# Altium schematic sheet BMU_V50_PackString.SchDoc
size C
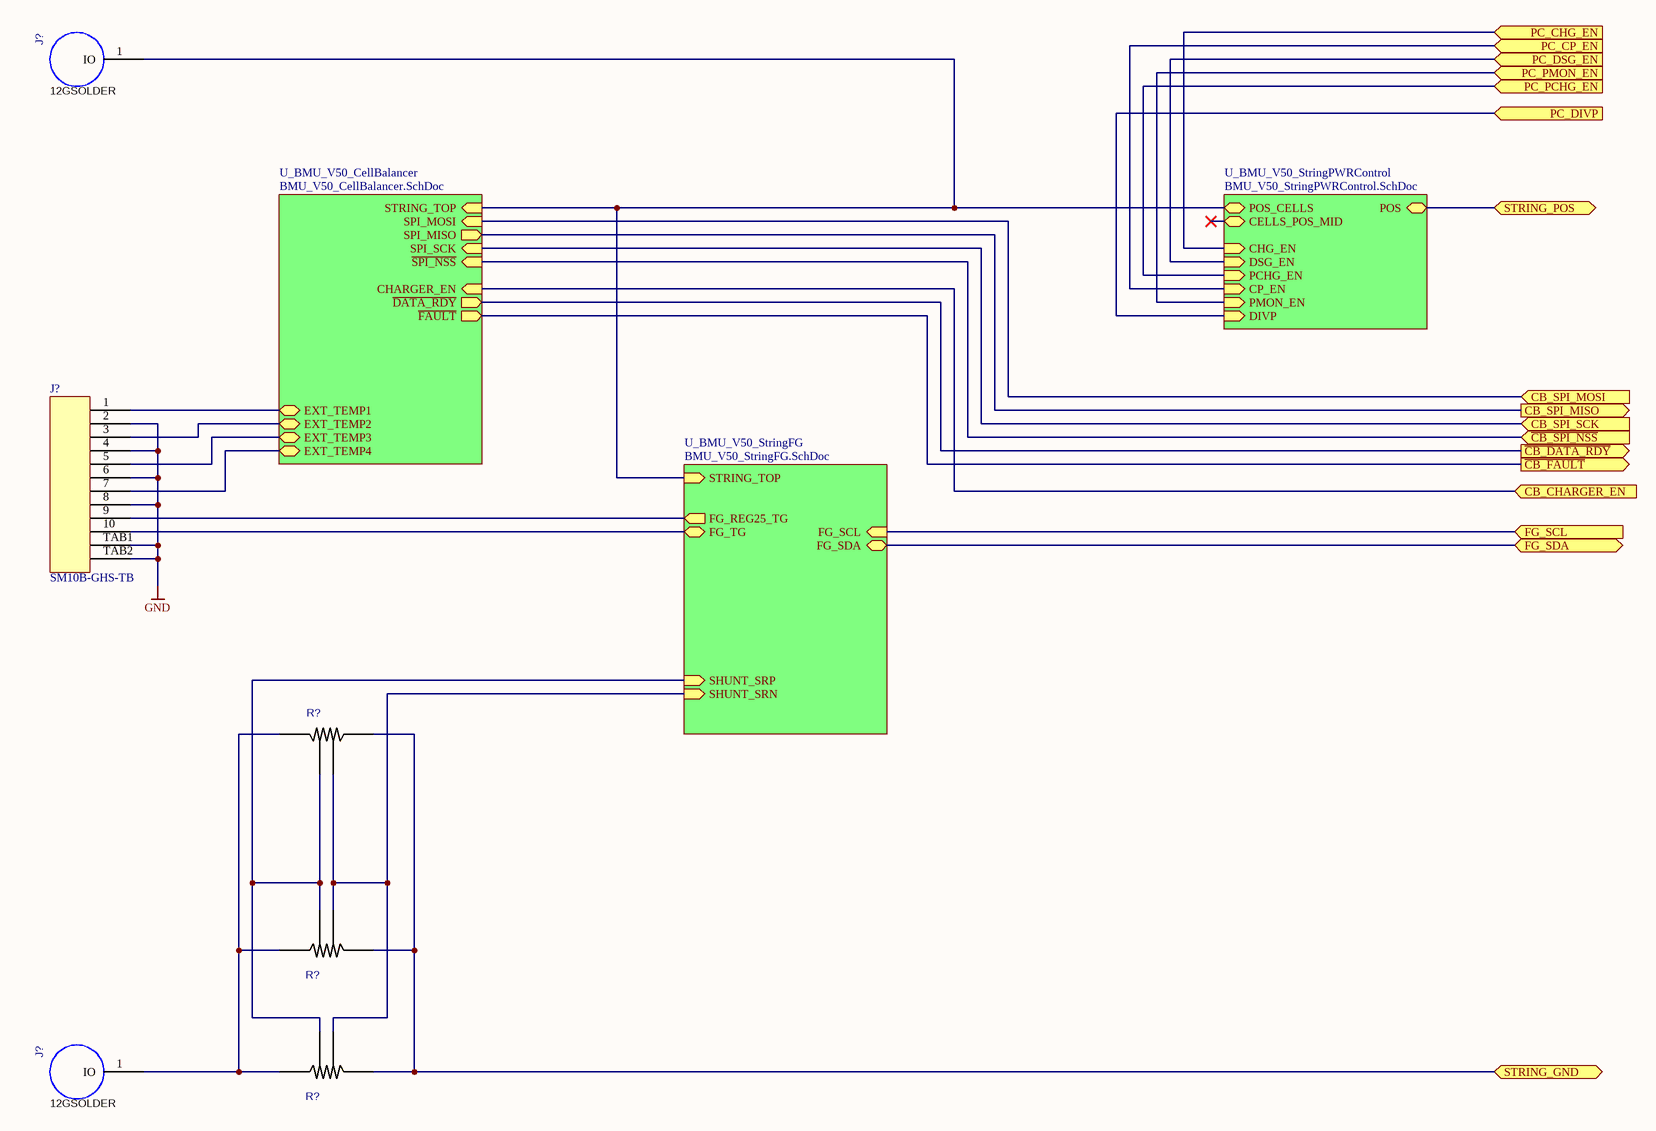
[diagram p0: BMU_V50_PackString.SchDoc]

## Parts
(Parts that share a designator on the sheet are numbered #1, #2 ... from top to bottom, then left to right.)
J?#1  12GSOLDER  [12GPAD]  (no BOM)
J?#2  SM10B-GHS-TB  [SM10B-GHS-TB]
J?#3  12GSOLDER  [12GPAD]  (no BOM)
R?#1  WSL59313L000FEA  [R5931]  (value not drawn)
R?#2  WSL59313L000FEA  [R5931]  (value not drawn)
R?#3  WSL59313L000FEA  [R5931]  (value not drawn)

## Sub-sheets
U_BMU_V50_CellBalancer = BMU_V50_CellBalancer.SchDoc: SPI_SCK (in), ~{SPI_NSS} (in), CHARGER_EN (in), SPI_MISO (out), ~{DATA_RDY} (out), ~{FAULT} (out), SPI_MOSI (in), STRING_TOP (in), EXT_TEMP4 (bidir), EXT_TEMP1 (bidir), EXT_TEMP2 (bidir), EXT_TEMP3 (bidir)
U_BMU_V50_StringFG = BMU_V50_StringFG.SchDoc: STRING_TOP (in), FG_REG25_TG (out), FG_SCL (in), FG_SDA (bidir), SHUNT_SRP (in), SHUNT_SRN (in), FG_TG (bidir)
U_BMU_V50_StringPWRControl = BMU_V50_StringPWRControl.SchDoc: DSG_EN (in), CP_EN (in), POS_CELLS (bidir), POS (bidir), CELLS_POS_MID (bidir), PCHG_EN (in), PMON_EN (in), DIVP (in), CHG_EN (in)

## Ports
CB_CHARGER_EN (in), CB_SPI_MISO (out), CB_SPI_MOSI (in), CB_SPI_SCK (in), FG_SCL (in), FG_SDA (bidir), PC_CHG_EN (in), PC_CP_EN (in), PC_DIVP (in), PC_DSG_EN (in), PC_PCHG_EN (in), PC_PMON_EN (in), STRING_GND (bidir), STRING_POS (bidir), ~{CB_DATA_RDY} (out), ~{CB_FAULT} (out), ~{CB_SPI_NSS} (in)

## Nets
GND: J?#2.2 J?#2.4 J?#2.6 J?#2.8 J?#2.TAB1 J?#2.TAB2
~{CB_DATA_RDY}: port ~{CB_DATA_RDY}, sheet U_BMU_V50_CellBalancer/~{DATA_RDY}
~{CB_FAULT}: port ~{CB_FAULT}, sheet U_BMU_V50_CellBalancer/~{FAULT}
~{CB_SPI_NSS}: port ~{CB_SPI_NSS}, sheet U_BMU_V50_CellBalancer/~{SPI_NSS}
CB_CHARGER_EN: port CB_CHARGER_EN, sheet U_BMU_V50_CellBalancer/CHARGER_EN
CB_SPI_MISO: port CB_SPI_MISO, sheet U_BMU_V50_CellBalancer/SPI_MISO
CB_SPI_MOSI: port CB_SPI_MOSI, sheet U_BMU_V50_CellBalancer/SPI_MOSI
CB_SPI_SCK: port CB_SPI_SCK, sheet U_BMU_V50_CellBalancer/SPI_SCK
FG_SCL: port FG_SCL, sheet U_BMU_V50_StringFG/FG_SCL
FG_SDA: port FG_SDA, sheet U_BMU_V50_StringFG/FG_SDA
PC_CHG_EN: port PC_CHG_EN, sheet U_BMU_V50_StringPWRControl/CHG_EN
PC_CP_EN: port PC_CP_EN, sheet U_BMU_V50_StringPWRControl/CP_EN
PC_DIVP: port PC_DIVP, sheet U_BMU_V50_StringPWRControl/DIVP
PC_DSG_EN: port PC_DSG_EN, sheet U_BMU_V50_StringPWRControl/DSG_EN
PC_PCHG_EN: port PC_PCHG_EN, sheet U_BMU_V50_StringPWRControl/PCHG_EN
PC_PMON_EN: port PC_PMON_EN, sheet U_BMU_V50_StringPWRControl/PMON_EN
STRING_GND: R?#1.2 R?#2.1 R?#3.1 ; port STRING_GND
STRING_POS: port STRING_POS, sheet U_BMU_V50_StringPWRControl/POS
NetJ?#1_1: J?#1.1(IO) ; sheet U_BMU_V50_StringFG/STRING_TOP, sheet U_BMU_V50_CellBalancer/STRING_TOP, sheet U_BMU_V50_StringPWRControl/POS_CELLS
NetJ?#2_1: J?#2.1 ; sheet U_BMU_V50_CellBalancer/EXT_TEMP1
NetJ?#2_3: J?#2.3 ; sheet U_BMU_V50_CellBalancer/EXT_TEMP2
NetJ?#2_5: J?#2.5 ; sheet U_BMU_V50_CellBalancer/EXT_TEMP3
NetJ?#2_7: J?#2.7 ; sheet U_BMU_V50_CellBalancer/EXT_TEMP4
NetJ?#2_9: J?#2.9 ; sheet U_BMU_V50_StringFG/FG_REG25_TG
NetJ?#2_10: J?#2.10 ; sheet U_BMU_V50_StringFG/FG_TG
NetJ?#3_1: J?#3.1(IO) R?#1.1 R?#2.2 R?#3.2
NetR?#1_3: R?#1.3 R?#2.4 R?#3.4 ; sheet U_BMU_V50_StringFG/SHUNT_SRP
NetR?#1_4: R?#1.4 R?#2.3 R?#3.3 ; sheet U_BMU_V50_StringFG/SHUNT_SRN

## Notes on the sheet
- Title
- MATTERNET
- PROPRIETRY & CONFIDENTIAL
  THE INFORMATION CONTAINS IN THIS DRAWING
  IS THE SOLE PROPERTY OF  MATTERNET Inc.
  ANY REPRODUCTION IN PART OR AS WHOLE
  WITHOUT A WRITTEN PERMISSION OF
  MATTERNET Inc. IS PROHIBITED
- Size:
- Date:
- File:
- C
- Number:
- Time:
- Revision:
- Sheet
- of
- 161 E. Evelyn Ave.
- Mountain View,
- CA 94041 USA

## Library data of the parts
J?#1 J?#3 = 12GSOLDER: Option: AB
J?#2 = SM10B-GHS-TB: CONN HEADER GH SIDE 10POS 1.25MM; System: Connector; ComponentLink1Description: JST GH Series Datasheet; ComponentLink1URL: http://www.jst-mfg.com/product/pdf/eng/eGH.pdf; Supplier 1: Digi-Key; Supplier Part Number 1: 455-1572-1-ND
R?#1-R?#3 = Res_4Term: RES SMD 3 MOHM 1% 5W 5931; Manufacturer 1: Vishay Dale; Resistance: 3mR; Temperature Coefficient: 75ppm/°C; Supplier 1: Digi-Key; Supplier Part Number 1: WSLN-.003CT-ND; Manufacturer Part Number 1: WSL59313L000FEA; RoHS: Yes; Category: Chip SMD Resistors; Stock 1: 2078; Pricing 1: 1=2.28000, 10=2.02300, 25=1.87600, 50=1.76560, 100=1.54490, 250=1.32424, 500=1.10354 (USD); Case/Package: 5931; Case Code (Imperial): 5931; Min Operating Temperature: -65°C; Max Operating Temperature: 170°C; Composition: Metal Element,Metal Strip; Number of Terminations: 2; Termination: SMD/SMT; Features: Moisture Resistant; Package Quantity: 1; Power Rating: 5W; Tolerance: 1%; Packaging: Tape and Reel; Max Power Dissipation: 5W; Length: 0.591inch; Height: 0.02inch; Width: 0.305inch
  R?#1: ComponentLink1URL: https://datasheet.ciiva.com/2484/wsl3921-2484790.pdf?src-supplier=Digi-Key; ComponentLink1Description: https://datasheet.ciiva.com/2484/wsl3921-2484790.pdf?src-supplier=Digi-Key; ComponentLink2URL: https://datasheet.ciiva.com/2484/wsl3921-2484791.pdf?src-supplier=Digi-Key; ComponentLink2Description: https://datasheet.ciiva.com/2484/wsl3921-2484791.pdf?src-supplier=Digi-Key; ComponentLink3URL: https://datasheet.ciiva.com/2484/wsl3921-2484792.pdf?src-supplier=Digi-Key; ComponentLink3Description: https://datasheet.ciiva.com/2484/wsl3921-2484792.pdf?src-supplier=Digi-Key
  R?#2 R?#3: ComponentLink1URL: http://www.farnell.com/datasheets/1678796.pdf; ComponentLink1Description: http://www.farnell.com/datasheets/1678796.pdf; ComponentLink2URL: http://industrial.panasonic.com/www-data/pdf/AOA0000/AOA0000CE1.pdf; ComponentLink2Description: http://industrial.panasonic.com/www-data/pdf/AOA0000/AOA0000CE1.pdf; ComponentLink3URL: http://www.mouser.com/ds/2/315/AOA0000C84-947596.pdf; ComponentLink3Description: http://www.mouser.com/ds/2/315/AOA0000C84-947596.pdf; ComponentLink4URL: https://www.alliedelec.com/m/d/51cd0790071e1666bdb9d00c57fcf960.pdf; ComponentLink4Description: https://www.alliedelec.com/m/d/51cd0790071e1666bdb9d00c57fcf960.pdf; ComponentLink5URL: http://www.vishay.com/docs/30110/wsl3921.pdf; ComponentLink5Description: http://www.vishay.com/docs/30110/wsl3921.pdf; ComponentLink6URL: https://datasheet.ciiva.com/2484/wsl3921-2484790.pdf?src-supplier=Digi-Key; ComponentLink6Description: https://datasheet.ciiva.com/2484/wsl3921-2484790.pdf?src-supplier=Digi-Key; ComponentLink7URL: https://datasheet.ciiva.com/2484/wsl3921-2484791.pdf?src-supplier=Digi-Key; ComponentLink7Description: https://datasheet.ciiva.com/2484/wsl3921-2484791.pdf?src-supplier=Digi-Key; ComponentLink8URL: https://datasheet.ciiva.com/2484/wsl3921-2484792.pdf?src-supplier=Digi-Key; ComponentLink8Description: https://datasheet.ciiva.com/2484/wsl3921-2484792.pdf?src-supplier=Digi-Key